# Altium schematic sheet AudioOUT.SchDoc
size A4; SheetNumber: 6; SheetTotal: 6
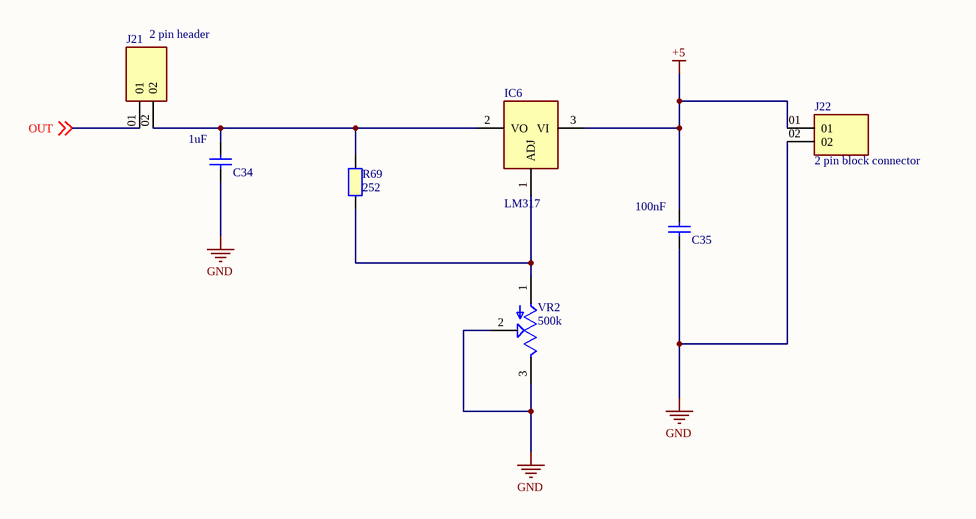
[diagram p0: AudioOUT.SchDoc]

## Parts
C34  1uF  [CAPC2012X65N]
C35  100nF  [CAPC2012X65N]
IC6  LM317  [TO-220]
J21  2 pin header  [SAMTEC_HTSW-102-07-TM-S]
J22  2 pin block connector  [691210910002]
R69  252  [RESC2012X50N]
VR2  500k  [TRIM_3362P-1-253LF]

## Nets
+5: C35.2 IC6.3(VI) J22.01
GND: C34.1 C35.1 J22.02 VR2.2(WIPER) VR2.3(CW)
OUT: J21.01 ; off-sheet OUT
NetC34_2: C34.2 IC6.2(VO) J21.02 R69.1
NetIC6_1: IC6.1(ADJ) R69.2 VR2.1(CCW)

## Library data of the parts
C34 = 885012004008: WCAP-CSGP Multilayer Ceramic Chip Capacitor, General Purpose, size 0201, NP0 Class I, 1uF, 25VDC; Manufacturer: Wurth Elektronik; Case/Size Code: 0201; Capacitance: 22pF; Capacitance Tolerance: +/-5%; Insulation Resistance: 10GΩ; Q Factor: 840; Rated Voltage (DC): 25V; Technical Reference: NP00201220J025DFCT10000; Manufacturer Part Number: 885012004008; Category: Multilayer Ceramic Chip Capacitors; Match Code: WCAP-CSGP; ComponentLink1Description: Website Link; ComponentLink1URL: https://www.we-online.com/redexpert/article/885012004008?ad; ComponentLink2Description: Datasheet Link; ComponentLink2URL: https://www.we-online.com/redexpert/spec/885012004008?ad; Mount: Surface Mount; Operating Temperature Max: 125°C; Operating Temperature Min: -55°C; Packaging: Tape and Reel; Length: 0.6mm; Width: 0.3mm; Height: 0.3mm; Ceramic Type: NP0 Class I
C35 = 885012004008: WCAP-CSGP Multilayer Ceramic Chip Capacitor, General Purpose, size 0201, NP0 Class I, 100nF, 25VDC; Manufacturer: Wurth Elektronik; Case/Size Code: 0201; Capacitance: 22pF; Capacitance Tolerance: +/-5%; Insulation Resistance: 10GΩ; Q Factor: 840; Rated Voltage (DC): 25V; Technical Reference: NP00201220J025DFCT10000; Manufacturer Part Number: 885012004008; Category: Multilayer Ceramic Chip Capacitors; Match Code: WCAP-CSGP; ComponentLink1Description: Website Link; ComponentLink1URL: https://www.we-online.com/redexpert/article/885012004008?ad; ComponentLink2Description: Datasheet Link; ComponentLink2URL: https://www.we-online.com/redexpert/spec/885012004008?ad; Mount: Surface Mount; Operating Temperature Max: 125°C; Operating Temperature Min: -55°C; Packaging: Tape and Reel; Length: 0.6mm; Width: 0.3mm; Height: 0.3mm; Ceramic Type: NP0 Class I
IC6 = LM317: Standard Regulator Pos 1.2V to 37V 0.25A 3-Pin(3+Tab) TO-220 Tube; MF: ON Semiconductor; Check_prices: https://www.snapeda.com/parts/LM317/Onsemi/view-part/?ref=eda; Value: *; Availability: In Stock; MP: LM317; Price: None; Package: None; SnapEDA_Link: https://www.snapeda.com/parts/LM317/Onsemi/view-part/?ref=snap; Purchase-URL: https://pricing.snapeda.com/search/part/LM317/?ref=eda
J21 = 2 pin header: 2 pin header Jumper; MP: HTSW10207TMS; MF: Samtec; SnapEDA_Link: https://www.snapeda.com/parts/HTSW10207TMS/Samtec/view-part/?ref=snap; Value: *; Purchase-URL: https://pricing.snapeda.com/search/part/HTSW10207TMS/?ref=eda; Availability: In Stock; Check_prices: https://www.snapeda.com/parts/HTSW10207TMS/Samtec/view-part/?ref=eda; Package: None; Price: None
J22 = 2 pin header: HEADER, 2 CONTACTS, 1 ROW, THROUGH HOLE, 2.54 MM; Connector Systems:Board-to-Board; Pitch Spacing:2.54mm; No. of Rows:1Rows; No. of Contacts:2Contacts; Contact Termination Type:Through Hole; Product Range:HTSW Series; Gender:Header RoHS Compliant: Yes; MP: HTSW10207TMS; MF: Samtec; SnapEDA_Link: https://www.snapeda.com/parts/HTSW10207TMS/Samtec/view-part/?ref=snap; Value: *; Purchase-URL: https://pricing.snapeda.com/search/part/HTSW10207TMS/?ref=eda; Availability: In Stock; Check_prices: https://www.snapeda.com/parts/HTSW10207TMS/Samtec/view-part/?ref=eda; Package: None; Price: None
R69 = RESISTOR 0805: 252 Resistor 0805; Part Number: TNPW080510K0BETA; Manufacturer: Vishay Dale
VR2 = 3362P-1-253LF: 25 kOhms 0.5W, 1/2W PC Pins Through Hole Trimmer Potentiometer Cermet 1 Turn Top Adjustment; MF: Bourns; Check_prices: https://www.snapeda.com/parts/3362P-1-253LF/Bourns/view-part/493663/?ref=eda; SnapEDA_Link: https://www.snapeda.com/parts/3362P-1-253LF/Bourns/view-part/493663/?ref=snap; Availability: Good; Value: *; Purchase-URL: https://pricing.snapeda.com/search/part/3362P-1-253LF/?ref=eda; Price: None; MP: 3362P-1-253LF; Package: 3116 Bourns